# EAGLE design POIstick2 (EAGLE 8.4.0)
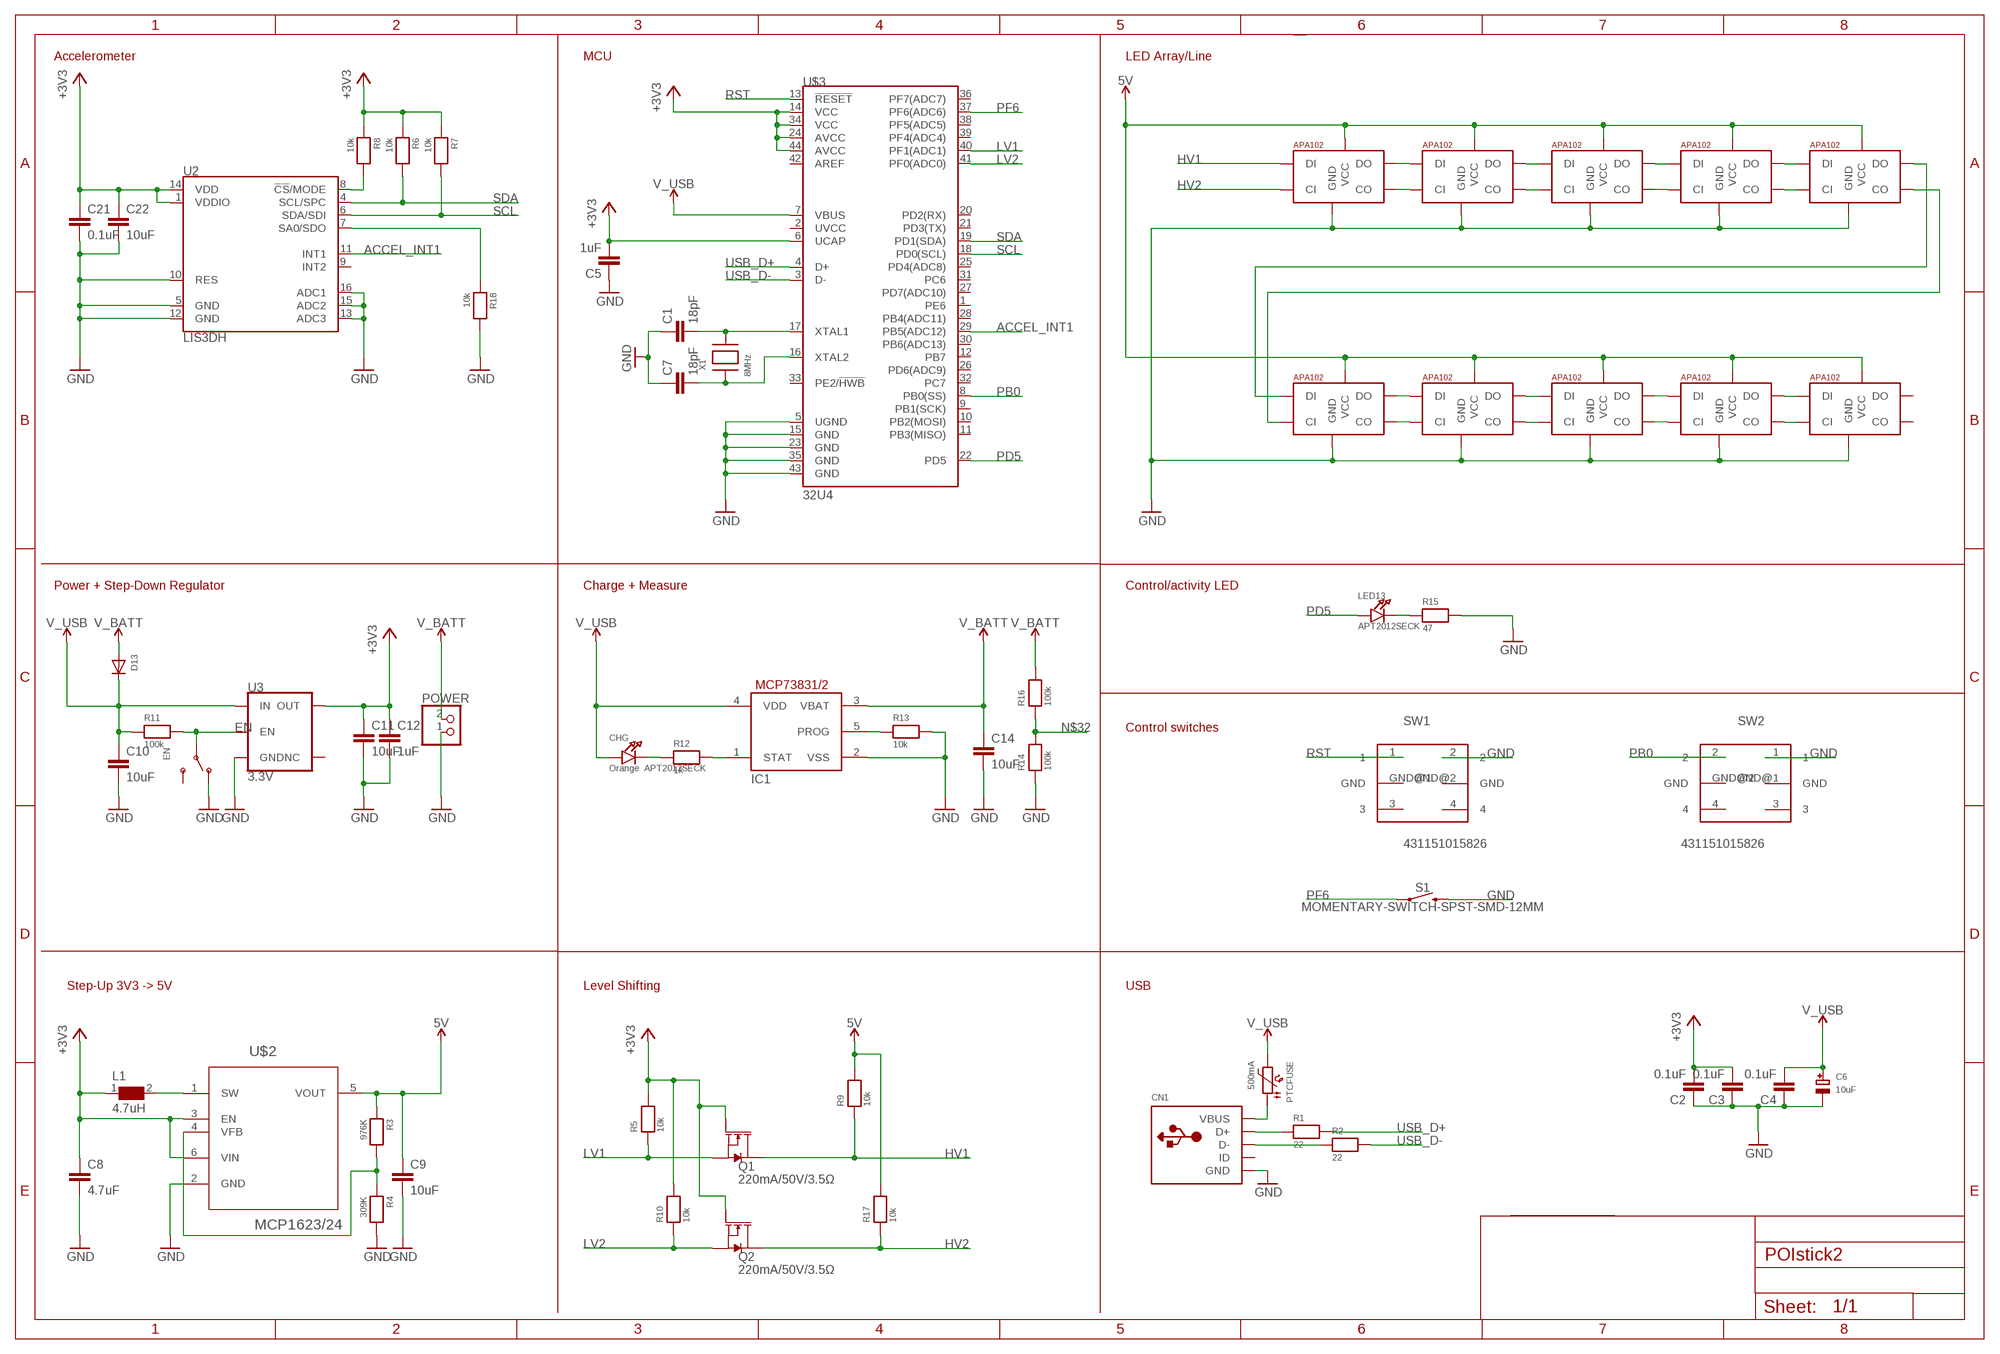
[diagram p0: schematic, sheet 1]

## Parts
C1  18pF  C-EUC0603K  [C0603K]
C2  0.1uF  C-EUC0603K  [C0603K]
C3  0.1uF  C-EUC0603K  [C0603K]
C4  0.1uF  C-EUC0603K  [C0603K]
C5  1uF  C-EUC0603K  [C0603K]
C6  10uF  CAP_TANTALUMA/3216_REFLOW  [EIA3216-18/A-R]
C7  18pF  C-EUC0603K  [C0603K]
C8  4.7uF  C-EUC0603K  [C0603K]
C9  10uF  C-EUC0603K  [C0603K]
C10  10uF  C-EUC0603K  [C0603K]
C11  10uF  C-EUC0603K  [C0603K]
C12  1uF  C-EUC0603K  [C0603K]
C14  10uF  C-EUC0603K  [C0603K]
C21  0.1uF  C-EUC0603K  [C0603K]
C22  10uF  C-EUC0603K  [C0603K]
CHG  Orange APT2012SECK  LED0603  [CHIPLED_0603]
CN1  USBMINIB  [USB-MINIB]
D13  DIODESOD-123  [SOD-123]
EN  SWITCH_SPDT  [SPDT_SMT_SSSS811101]
IC1  MCP73831/OT  [SOT23-5L]
L1  4.7uH  WE-TPC-744031004_3816  [WE-TPC_3816]
LED13  APT2012SECK  LED0603  [CHIPLED_0603]
POWER  JST_2PIN-THM  [JST-PH-2-THM]
PTCFUSE  500mA  PTC1206  [1206]
Q1  220mA/50V/3.5Ω  MOSFET-NCH-BSS138  [SOT23-3]
Q2  220mA/50V/3.5Ω  MOSFET-NCH-BSS138  [SOT23-3]
R1  22  RESISTOR0603  [0603]
R2  22  RESISTOR0603  [0603]
R3  976K  RESISTOR0603  [0603]
R4  309K  RESISTOR0603  [0603]
R5  10k  RESISTOR0603  [0603]
R6  10k  RESISTOR0603  [0603]
R7  10k  RESISTOR0603  [0603]
R8  10k  RESISTOR0603  [0603]
R9  10k  RESISTOR0603  [0603]
R10  10k  RESISTOR0603  [0603]
R11  100k  RESISTOR0603  [0603]
R12  1k  RESISTOR0603  [0603]
R13  10k  RESISTOR0603  [0603]
R14  100k  RESISTOR0603  [0603]
R15  47  RESISTOR0603  [0603]
R16  100k  RESISTOR0603  [0603]
R17  10k  RESISTOR0603  [0603]
R18  10k  RESISTOR0603  [0603]
S1  MOMENTARY-SWITCH-SPST-SMD-12MM  [TACTILE_SWITCH_SMD_12MM]
SW1  431151015826  [431181015816]
SW2  431151015826  [431181015816]
U2  LIS3DH  [LGA-16-3X3]
U3  3.3V  V_REG_AP2112K-3.3V  [SOT23-5]
U$2  MCP1623/24  [SOT95P300X120-6N]
U$3  32U4  ATMEGA32U4QFN  [QFN-44]
U$4  APA1025050  [APA102_5050]
U$5  APA1025050  [APA102_5050]
U$6  APA1025050  [APA102_5050]
U$7  APA1025050  [APA102_5050]
U$8  APA1025050  [APA102_5050]
U$9  APA1025050  [APA102_5050]
U$10  APA1025050  [APA102_5050]
U$11  APA1025050  [APA102_5050]
U$12  APA1025050  [APA102_5050]
U$13  APA1025050  [APA102_5050]
X1  8MHz  XTALNX5032  [NX5032]

## Nets
5V: C9.1 R3.1 R9.2 R17.2 U$2.5(VOUT) U$4.1(VCC) U$5.1(VCC) U$6.1(VCC) U$7.1(VCC) U$8.1(VCC) U$9.1(VCC) U$10.1(VCC) U$11.1(VCC) U$12.1(VCC) U$13.1(VCC)
+3V3: C2.2 C3.2 C5.2 C8.1 C11.1 C12.1 C21.1 C22.1 L1.1 Q1.1(G) Q2.1(G) R5.2 R6.1 R7.1 R8.1 R10.2 U2.1(VDDIO) U2.14(VDD) U3.5(OUT) U$2.3(EN) U$2.6(VIN) U$3.24(AVCC) U$3.44(AVCC)
ACCEL_INT1: U2.11(INT1) U$3.29(PB5(ADC12))
EN: EN.B(P) R11.2 U3.3(EN)
GND: C1.1 C2.1 C3.1 C4.1 C5.1 C6.- C7.1 C8.2 C9.2 C10.2 C11.2 C12.2 C14.2 C21.2 C22.2 CN1.GND EN.A(O) IC1.2(VSS) POWER.1 R4.2 R13.2 R14.1 R15.2 R18.2 S1.3 SW1.2 SW2.1 U2.5(GND) U2.10(RES) U2.12(GND) U2.13(ADC3) U2.15(ADC2) U2.16(ADC1) U3.2(GND) U$2.2(GND) U$4.6(GND) U$5.6(GND) U$6.6(GND) U$7.6(GND) U$8.6(GND) U$9.6(GND) U$10.6(GND) U$11.6(GND) U$12.6(GND) U$13.6(GND)
HV1: Q1.3(D) R9.1 U$4.4(DI)
HV2: Q2.3(D) R17.1 U$4.5(CI)
LV1: Q1.2(S) R5.1 U$3.40(PF1(ADC1))
LV2: Q2.2(S) R10.1 U$3.41(PF0(ADC0))
N$1: CN1.D+ R1.1
N$2: CN1.D- R2.1
N$3: R3.2 R4.1 U$2.4(VFB)
N$4: R18.1 U2.7(SA0/SDO)
N$5: CN1.VBUS PTCFUSE.1
N$6: C7.2 U$3.16(XTAL2) X1.P$1
N$7: C1.2 U$3.17(XTAL1) X1.P$2
N$8: U$4.3(DO) U$5.4(DI)
N$9: U$4.2(CO) U$5.5(CI)
N$10: U$5.3(DO) U$6.4(DI)
N$11: U$5.2(CO) U$6.5(CI)
N$12: U$6.3(DO) U$7.4(DI)
N$13: U$6.2(CO) U$7.5(CI)
N$14: U$7.3(DO) U$8.4(DI)
N$15: U$7.2(CO) U$8.5(CI)
N$16: U$8.3(DO) U$9.4(DI)
N$17: U$8.2(CO) U$9.5(CI)
N$18: R8.2 U2.8(!CS!/MODE)
N$19: L1.2 U$2.1(SW)
N$21: U$9.3(DO) U$10.4(DI)
N$22: U$9.2(CO) U$10.5(CI)
N$24: U$10.2(CO) U$11.5(CI)
N$25: U$10.3(DO) U$11.4(DI)
N$26: IC1.1(STAT) R12.2
N$27: U$11.3(DO) U$12.4(DI)
N$28: CHG.C R12.1
N$29: U$11.2(CO) U$12.5(CI)
N$30: IC1.5(PROG) R13.1
N$31: U$12.2(CO) U$13.5(CI)
N$32: LED13.C R14.2 R15.1 R16.1
N$35: U$12.3(DO) U$13.4(DI)
PB0: SW2.2 U$3.8(PB0(SS))
PD5: LED13.A U$3.22(PD5)
PF6: S1.1 U$3.37(PF6(ADC6))
RST: SW1.1 U$3.13(!RESET)
SCL: R7.2 U2.6(SDA/SDI) U$3.18(PD0(SCL))
SDA: R6.2 U2.4(SCL/SPC) U$3.19(PD1(SDA))
USB_D+: R1.2 U$3.4(D+)
USB_D-: R2.2 U$3.3(D-)
V_BATT: C14.1 D13.A IC1.3(VBAT) POWER.2 R16.2
V_USB: C4.2 C6.+ C10.1 CHG.A D13.C IC1.4(VDD) PTCFUSE.2 R11.1 U3.1(IN) U$3.7(VBUS)
Unconnected: CN1.ID EN.C(S) SW1.3 SW1.4 SW1.GND@1(GND) SW1.GND@2(GND) SW2.3 SW2.4 SW2.GND@1(GND) SW2.GND@2(GND) U2.9(INT2) U3.4(NC) U$3.1(PE6) U$3.2(UVCC) U$3.5(UGND) U$3.6(UCAP) U$3.9(PB1(SCK)) U$3.10(PB2(MOSI)) U$3.11(PB3(MISO)) U$3.12(PB7) U$3.14(VCC) U$3.15(GND) U$3.20(PD2(RX)) U$3.21(PD3(TX)) U$3.23(GND) U$3.25(PD4(ADC8)) U$3.26(PD6(ADC9)) U$3.27(PD7(ADC10)) U$3.28(PB4(ADC11)) U$3.30(PB6(ADC13)) U$3.31(PC6) U$3.32(PC7) U$3.33(PE2/!HWB) U$3.34(VCC) U$3.35(GND) U$3.36(PF7(ADC7)) U$3.38(PF5(ADC5)) U$3.39(PF4(ADC4)) U$3.42(AREF) U$3.43(GND) U$13.2(CO) U$13.3(DO)

## Notes on the sheet
- Accelerometer | MCU | LED Array/Line
- Power + Step-Down Regulator | Charge + Measure | Control/activity LED
- Control switches
- Step-Up 3V3 -> 5V | Level Shifting | USB

## Library data of the parts
C1-C5 C7-C12 C14 C21 C22 = rcl:C-EU: CAPACITOR, European symbol
C6 = microbuilder:CAP_TANTALUM: Tantalum Capacitors Wave footprints have larger pads and are meant to be used for hand soldering. Reflow footprints are optimised for solder paste and a reflow oven. EIA3216-18/A-[R/W] - Size A / 3216-18 / 1206 footprint 4.7µF 25V 10% Tantalum Capacitor 10µF 16V 10% Tantalum Capacitor [Digikey: 495-2236-2-ND] EIA3528-21/B-[R/W] - Size B / 3528-21 47µF 10V 10% Tantalum Capactior [Digikey: 495-2216-1-ND] EIA6032-28/C-[R/W] - Size C / 6032-28 10µF 35V 20% Tantalum Capacitor [Digikey: 495-2285-1-ND] 100µF 16V 10% Tantalum Capactior [Digikey: 399-5214-1-ND]
CHG LED13 = microbuilder:LED: LED 0603 - 0603 Surface Mount Package 2mA: Green LED - Low Power (3.9mcd, 2ma, 1.7Vf) - Digikey: 475-2709-2-ND Orange LED - Low Power (9.8mcd, 2ma, 1.8Vf) - Digikey: 475-1194-2-ND Red LED - Low Power (5mcd, 2ma, 1.8Vf) - Digikey: 475-1195-2-ND Yellow LED - Low Power (7mcd, 2ma, 1.8Vf) - Digikey: 475-1196-2-ND 5mA: Blue LED - Low Power (17mcd, 5ma, 2.9Vf) - Digikey: LNJ937W8CRACT-ND 0805 - 0805 Surface Mount Package 2mA: Red LED (8.8mcd, 2mA, 1.8Vf, Clear) - Low Power [Digikey: 475-2510-1-ND] Green LED (5mcd, 2mA, 1.8Vf, Clear) - Low Power [Digikey: 475-2730-1-ND] Yellow LED (11.3mcd, 2mA, 1.8Vf, Clear) - Low Power [Digikey: 475-2555-1-ND] 20mA: Red LED (104mcd, 20mA, Diffused) - LS R976 [Digikey: 475-1278-6-ND] Red LED (12mcd, 20mA, 2.0Vf, Clear) - APT2012EC [Digikey: 754-1128-1-ND] Green LED (15mcd, 20mA, 2.2Vf, Clear) - APT2012GC [Digikey: 754-1131-1-ND] Orange LED (160mcd, 20mA, 2.1Vf, Clear) - APT2012SECK [Digikey: 754-1130-1-ND] 1206 - 1206 Surface Mount Package Green LED (26mcd, 20mA, Diffused) - LG N971 [Digikey: 475-1407-6-ND] Red LED (15mcd, 20mA, Diffused) - LH N974 [Digikey: 475-1416-6-ND]
CN1 = adafruit:USB: USB Connectors USBMINIB - Surface Mount Female Mini-B USB Connector 4UConnector: 06564 By microbuilder.eu Thru-hole RA Female Mini-B USB Connector 4UConnector: 18732 By ladyada.net
D13 = adafruit:DIODE: Diode SMADIODE - SMA Surface Mount Package 20V 1A Schottky Diode Digikey: 641-1014-6-ND DO-1N4148 - Through Hole Small Current Diode SOD-123 20V 1 A (.5mV Vf) Schottky Diode - Digikey: MBRX120TPMSCT-ND SOD-323 10V 570mA (.38mV Vf, 3ns) Schottky Diode - Digikey: ZLLS410CT-ND SOD-523 30V 30mA Schottky Diode (RB751S-40TE61) - Digikey: RB751S-40TE61CT-ND SOT23-R/W - SOT23 Package (R = Solder Paste/Reflow Ovens, W = Hand-Soldering) BAT54Film 40V 300mA - Digikey: 497-7162-1-ND
EN = microbuilder:SWITCH_SPDT: Switch - SPDT SSSS811101 - Horizontal Two Position SMT, 0.3A 4V [Mouser: 688-SSSS811101]
IC1 = adafruit:MCP73831: MCP73831/2 Miniature Single-Cell, Fully Integrated Li-Ion, Li-Polymer Charge Management Controllers. Nice and small simple lipoly charge controller, with adjustable current and status output (LED) http://www.ladyada.net/library/pcb/eaglelibrary.html
L1 = WE-TPC:WE-TPC: Shielded Tiny Power Inductor WE-TPC - Extremely flat power inductor - High current capability - High reliability and perfect soldering characteristics because of integrated soldering pad - magnetically shielded -- Portable power like PDA, digital camera, PCMICA-cards and displays -- DC/DC-converter -- Recommended for switching regulator IC's from Linear Technology, National Semiconductor, Texas Instruments and Fairchild Semiconductor; MPN: 744031004; OC_FARNELL: 1635834; OC_NEWARK: 08P2473; PACKAGE: 3816; SUPPLIER: WURTH ELEKTRONIK
POWER = adafruit:JST_2PIN: JST 2-Pin Connectors of various flavors SMT-RA (S2B-PH-SM4) 4UConnector #17311 SMT (B2B-PH-SM4) THM-RA (S2B-PH) THM (B2B-PH)
PTCFUSE = microbuilder:PTC: PTC (Resettable Fuse) 1206 Package 250mA PTC (16V Max, Time-to-Trip: 0.08s) - Digikey: F2110CT-ND 1210 Package 100mA PTC (30V Max, Time-to-Trip: 0.6s) - Digikey: MF-USMF010-2CT-ND 1812 Package 750mA PTC (24V Max, Time-to-Trip: 0.2s) - Digikey: MF-MSMF075/24-2CT-ND
Q1 Q2 = SparkFun-DiscreteSemi:MOSFET-NCH: N-channel MOSFETs Voltage controlled devices that allow control of high current outputs. SparkFun Products: SparkFun OpenScale <https://www.sparkfun.com/products/13261> SparkFun Digital Sandbox <https://www.sparkfun.com/products/12651> SparkFun Monster Moto Shield <https://www.sparkfun.com/products/10182> SparkFun MOSFET Power Controller <https://www.sparkfun.com/products/11214>; PROD_ID: TRANS-00830
R1-R18 = microbuilder:RESISTOR: Resistors 0402 - 0402 Surface Mount Package 22 Ohm 1% 1/16W [Digikey: 311-22.0LRTR-ND] 33 Ohm 5% 1/16W 1.0K 5% 1/16W 1.5K 5% 1/16W 2.0K 1% 1/16W 10.0K 1% 1/16W [Digikey: 311-10.0KLRTR-ND] 10.0K 5% 1/16W [Digikey: RMCF0402JT10K0TR-ND] 12.1K 1% 1/16W [Digikey: 311-22.0LRTR-ND] 100.0K 5% 1/16W 0603 - 0603 Surface Mount Package 0 Ohm 1/10 Watt 1% Resistor 15 Ohm 1/10 Watt 1% Resistor 33 Ohm 1/10 Watt 1% Resistor 49.9 Ohm 1/10 Watt 1% Resistor 100 Ohm 1/10 Watt 1% Resistor 150 Ohm 1/10 Watt 1% Resistor 240 Ohm 1/10 Watt 1% Resistor 390 Ohm 1/10 Watt 1% Resistor 560 Ohm 1/10 Watt 1% Resistor 680 Ohm 1/10 Watt 1% Resistor 750 Ohm 1/10 Watt 1% Resistor 1.0K Ohm 1/10 Watt 1% Resistor 1.5K Ohm 1/10 Watt 1% Resistor 2.0K Ohm 1/10 Watt 1% Resistor 2.2K Ohm 1/10 Watt 1% Resistor 3.3K Ohm 1/10 Watt 1% Resistor 4.7K Ohm 1/10 Watt 1% Resistor 10.0K Ohm 1/10 Watt 1% Resistor 12.0K Ohm 1/10 Watt 1% Resistor 12.1K Ohm 1/10 Watt 1% Resistor 20.0K Ohm 1/10 Watt 1% Resistor 33.0K Ohm 1/10 Watt 1% Resistor 100.0K Ohm 1/10 Watt 1% Resistor 0805 - 0805 Surface Mount Package 0 Ohm 1/8 Watt 1% Resistor 33 Ohm 1/8 Watt 1% Resistor 100 Ohm 1/8 Watt 1% Resistor 150 Ohm 1/8 Watt 1% Resistor 200 Ohm 1/8 Watt 1% Resistor 240 Ohm 1/8 Watt 1% Resistor 330 Ohm 1/8 Watt 1% Resistor 390 Ohm 1/8 Watt 1% Resistor 470 Ohm 1/8 Watt 1% Resistor 1.0K Ohm 1/8 Watt 1% Resistor 1.5K Ohm 1/8 Watt 1% Resistor 2.0K Ohm 1/8 Watt 1% Resistor 4.7K Ohm 1/8 Watt 1% Resistor 5.1K Ohm 1/8 Watt 1% Resistor 5.6K Ohm 1/8 Watt 1% Resistor 10.0K Ohm 1/8 Watt 1% Resistor 22.0K Ohm 1/8 Watt 1% Resistor 33.0K Ohm 1/8 Watt 1% Resistor 100K Ohm 1/8 Watt 1% Resistor 1206 - 1206 Surface Mount Package 2012 - 2010 Surface Mount Package 0.11 Ohm 1/2 Watt 1% Resistor - Digikey: RHM.11UCT-ND
S1 = SparkFun-Switches:MOMENTARY-SWITCH-SPST: Momentary Switch (Pushbutton) - SPST Normally-open (NO) SPST momentary switches (buttons, pushbuttons). Variants PTH-12MM - 12mm square, through-hole Momentary Pushbutton Switch - 12mm Square <https://www.sparkfun.com/products/9190> (COM-09190) PTH-6.0MM, PTH-6.0MM-KIT - 6.0mm square, through-hole Mini Pushbutton Switch <https://www.sparkfun.com/products/97> (COM-00097) KIT package intended for soldering kit's - only one side of pads' copper is exposed. PTH-RIGHT-ANGLE-KIT - Right-angle, through-hole Right Angle Tactile Button <https://www.sparkfun.com/products/10791> - Used on SparkFun BigTime Watch Kit <https://www.sparkfun.com/products/11734> SMD-12MM - 12mm square, surface-mount Tactile Button - SMD (12mm) <https://www.sparkfun.com/products/12993> (COM-12993) Used on SparkFun PicoBoard <https://www.sparkfun.com/products/11888> SMD-4.5MM - 4.5mm Square Trackball Switch Used on SparkFun Blackberry Trackballer Breakout <https://www.sparkfun.com/products/13169> SMD-4.6MMX2.8MM - 4.60mm x 2.80mm, surface mount Used on SparkFun SAMD21 Mini Breakout <https://www.sparkfun.com/products/13664> SMD-5.2MM, SMD-5.2-REDUNDANT - 5.2mm square, surface-mount Mini Pushbutton Switch - SMD <https://www.sparkfun.com/products/8720> (COM-08720) Used on Arduino Pro Mini <https://www.sparkfun.com/products/11114> REDUNDANT package connects both switch circuits together SMD-6.0X3.5MM - 6.0 x 3.5mm, surface mount Momentary Reset Switch SMD <https://www.sparkfun.com/products/8229> (COM-08229) SMD-6.2MM-TALL - 6.2mm square, surface mount Tactile Button - SMD (6mm) <https://www.sparkfun.com/products/12992> Used on SparkFun Digital Sandbox <https://www.sparkfun.com/products/12651> SMD-RIGHT-ANGLE - Right-angle, surface mount Used on SparkFun Block for Intel® Edison - Arduino <https://www.sparkfun.com/products/13036>; PROD_ID: SWCH-11967; SF_SKU: COM-12993
SW1 SW2 = Wurth_Elektronik_Electromechanic_Switchs_rev15b:431151015826: WS-TSS-5x5 mm SMD Tact Switch with ground terminal, 4 pins
U2 = SparkFun-Sensors:LIS3DH: ST Microelectronics LIS3DH 3-Axis ±2/4/8/16g SPI/I2C Accelerometer The LIS3DH is a three axis MEMS linear accelerometer in the "nano" family. It has a digital I2C/SPI serial interface which makes it ideal for using in embedded applications. The device also features ultra low-power operational modes that allow advanced power saving and smart sleep to wake-up functions, built in detections with interrupts, and auxiliary ADC inputs Datasheet-XXXX <http://www.sparkfun.com/datasheets/Sensors/Accelerometer/LIS3DH.pdf> SparkFun Products SparkFun Triple Axis Accelerometer Breakout - LIS3DH <https://www.sparkfun.com/products/10345> (SEN-XXXXX) Triple Axis Accelerometer - LIS3DH <https://www.sparkfun.com/products/9755> (SEN-XXXXX); PROD_ID: IC-13419; SF_ID: N/A
U3 = SparkFun-IC-Power:V_REG_AP2112: AP2112 - 600mA CMOS LDO Regulator w/ Enable The AP2112 is CMOS process low dropout linear regulator with enable function, the regulator delivers a guaranteed 600mA (min.) continuous load current. Features Output Voltage Accuracy: ±1.5% Output Current: 600mA (Min.) Foldback Short Current Protection: 50mA Enable Function to Turn ON/OFF VOUT Low Dropout Voltage (3.3V): 250mV (Typ.) @IOUT=600mA Excellent Load Regulation: 0.2%/A (Typ.) Excellent Line Regulation: 0.02%/V (Typ.) Low Quiescent Current: 55μA (Typ.) Low Standby Current: 0.01μA (Typ.) Low Output Noise: 50μVRMS PSRR: 100Hz -65dB, 1kHz -65dB OTSD Protection Stable with 1.0μF Flexible Cap: Ceramic, Tantalum and Aluminum Electrolytic Operation Temperature Range: -40°C to 85°C ESD: MM 400V, HBM 4000V; PROD_ID: VREG-12457
U$2 = MCP1623:MCP1623/24: IC, BOOST, REG, PWM/PFM, SOT-23-6 Primary Input Voltage: 5.5V No. of Outputs: 1 Output Voltage: 5.5V Output Current: 50mA Voltage Regulator Case Style: SOT-23 No. of Pins: 6 Operating Temperature Range: -40°C to +85°C SVHC: No SVHC (18-Jun-2012) Base Number: 1623
U$3 = SparkFun-IC-Microcontroller:ATMEGA32U4: Atmel MCU, 32KByte Atmel 44-pin 8-bit Microcontroller with 32KBytes of ISP Flash and USB Controller Datasheet <http://cdn.sparkfun.com/datasheets/Dev/Arduino/Boards/ATMega32U4.pdf> SparkFun Products LilyPad Arduino USB - ATmega32U4 Board <https://www.sparkfun.com/products/12049> (DEV-12049) Pro Micro - 5V/16MHz <https://www.sparkfun.com/products/12640> (DEV-12640) Pro Micro - 3.3V/8MHz <https://www.sparkfun.com/products/12587> (DEV-12587) Fio v3 - ATmega32U4 <https://www.sparkfun.com/products/11520> (DEV-11520) Qduino Mini <https://www.sparkfun.com/products/13614> (DEV-13614) Makey Makey - Standard Kit <https://www.sparkfun.com/products/11511> (WIG-11511) Makey Makey Deluxe Kit <https://www.sparkfun.com/products/11519> (WIG-11519); PROD_ID: IC-10828
U$4-U$13 = jos-ph:APA102: APA102C 5050 RGB LED -- Adafruit DotStar Single LED Pixel Product Page: https://www.adafruit.com/products/2343 Datasheet: https://cdn-shop.adafruit.com/product-files/2343/APA102C.pdf
X1 = adafruit:XTAL: Low cost SMT crystals, no capacitors included http://www.ladyada.net/library/eagle

## Board
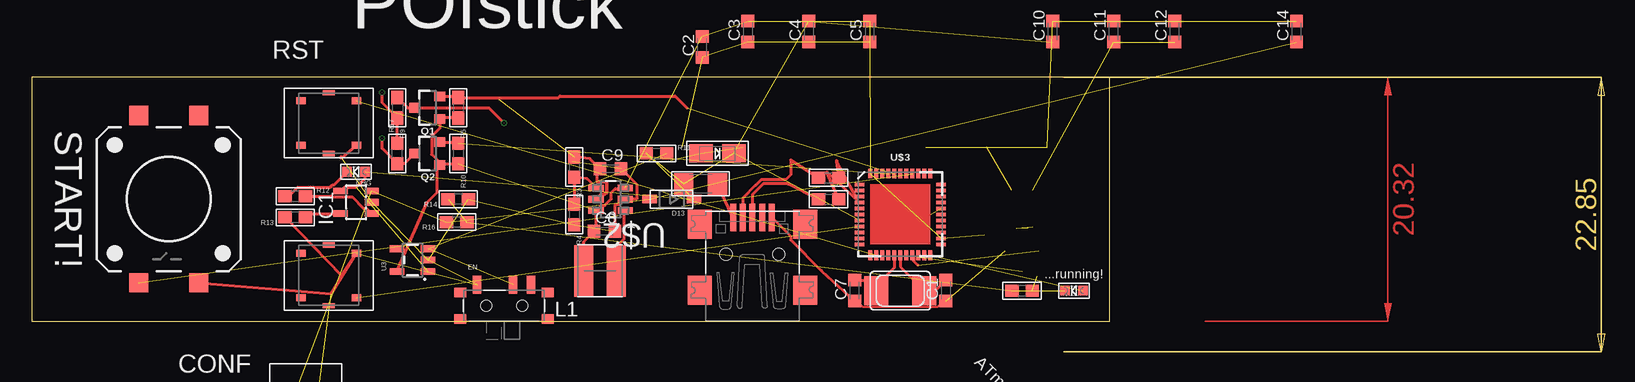
[diagram p1: board, top side]
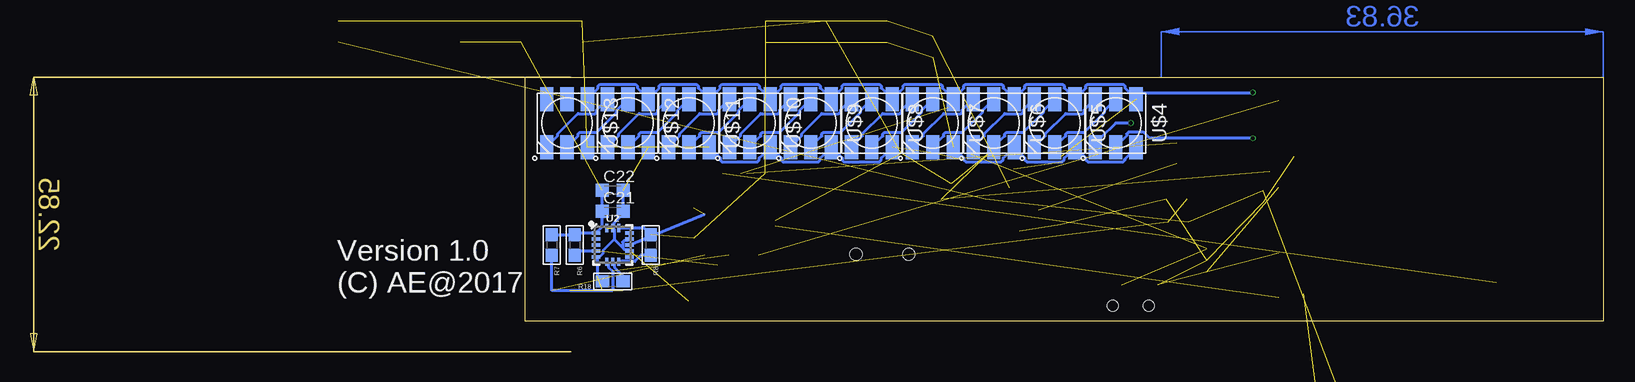
[diagram p2: board, bottom side, seen from below]

Size 89.84 x 20.31 mm. Coordinates in mm from the lower left corner, seen from the top.
Outline: 0,0 89.84,0 89.84,20.31 0,20.31 0,0
Copper layers (1*16): Top 0.035mm / dielectric 1.5mm / Bottom 0.035mm
Design rules "aisler_go_2layer": minimum track width 0.1mm, minimum drill 0.2mm, track to track 0.1mm, track to pad 0.1mm, pad to pad 0.1mm, via to via 0.1mm, smd to smd 0.1mm, copper to edge 0.2mm, drill to drill 0.21mm, minimum pad ring 0.25mm, minimum via ring 0.05mm, stop-mask expansion 0.01mm, vias tented up to drill 0mil, thermal gap 10mil

### Footprints (pad centres in the part's own frame; a part is rotated, then mirrored left to right if it is on the bottom)
C0603K = smd 1.05 x 1.08: 1 -0.875,0; 2 0.875,0
EIA3216-18/A-R = smd 1.95 x 1.5: + 1.375,0; - -1.375,0
CHIPLED_0603 = smd 0.8 x 0.8: A 0,-0.75; C 0,0.75
USB-MINIB = smd 0.5 x 2.308: D+ 0,4.064; D- -0.8,4.064; GND 1.6,4.064; ID 0.8,4.064; VBUS -1.6,4.064 | smd 2 x 2.4: GND1 -4.4,-2; GND2 -4.4,3.5; GND3 4.4,3.5; GND4 4.4,-2 | hole 1: -2.2,1; 2.2,1
SOD-123 = smd 1.2 x 0.7: A 1.85,0; C -1.85,0
SPDT_SMT_SSSS811101 = smd 0.7 x 1.5: A -2.25,1.75; B 0.75,1.75; C 2.25,1.75 | smd 1 x 0.8: SUP1 -3.65,1.1; SUP2 -3.65,-1.1; SUP3 3.65,1.1; SUP4 3.65,-1.1 | hole 0.9: -1.5,0; 1.5,0
SOT23-5L = smd 0.55 x 1.2: 1 -0.95,-1.3; 2 0,-1.3; 3 0.95,-1.3; 4 0.95,1.3; 5 -0.95,1.3
WE-TPC_3816 = smd 1.6 x 4.3: 1 -1.356,-0.014; 2 1.356,-0.014
JST-PH-2-THM = drill 0.8 pad 1.422: 1 1,0; 2 -1,0
1206 = smd 1.6 x 1.8: 1 -1.4,0; 2 1.4,0
SOT23-3 = smd 0.8 x 0.9: 1 -0.95,-1; 2 0.95,-1; 3 0,1.1
0603 = smd 1.1 x 1: 1 -0.85,0; 2 0.85,0
TACTILE_SWITCH_SMD_12MM = smd 1.6 x 1.55: 1 6.975,-2.5; 2 -6.975,-2.5; 3 6.975,2.5; 4 -6.975,2.5
431181015816 = smd 0.8 x 0.6: 1 -2.3,-1.85; 2 -2.3,1.85; 3 2.3,-1.85; 4 2.3,1.85 | smd 1 x 0.45: GND@1 0,-2.525; GND@2 0,2.525
LGA-16-3X3 = smd 0.7 x 0.28: 1 -1.4,1; 2 -1.4,0.5; 3 -1.4,0; 4 -1.4,-0.5; 5 -1.4,-1; 9 1.4,-1; 10 1.4,-0.5; 11 1.4,0; 12 1.4,0.5; 13 1.4,1 | smd 0.28 x 0.7: 6 -0.5,-1.4; 7 0,-1.4; 8 0.5,-1.4; 14 0.5,1.4; 15 0,1.4; 16 -0.5,1.4
SOT23-5 = smd 0.55 x 1.2: 1 -0.95,-1.3; 2 0,-1.3; 3 0.95,-1.3; 4 0.95,1.3; 5 -0.95,1.3
SOT95P300X120-6N = smd 1.27 x 0.559: 1 -1.219,0.94; 2 -1.219,0; 3 -1.219,-0.94; 4 1.219,-0.94; 5 1.219,0; 6 1.219,0.94
QFN-44 = smd 0.8 x 0.3: 1 -3.4,2.5; 2 -3.4,2; 3 -3.4,1.5; 4 -3.4,1; 5 -3.4,0.5; 6 -3.4,0; 7 -3.4,-0.5; 8 -3.4,-1; 9 -3.4,-1.5; 10 -3.4,-2; 11 -3.4,-2.5; 23 3.4,-2.5; 24 3.4,-2; 25 3.4,-1.5; 26 3.4,-1; 27 3.4,-0.5; 28 3.4,0; 29 3.4,0.5; 30 3.4,1; 31 3.4,1.5; 32 3.4,2; 33 3.4,2.5 | smd 0.3 x 0.8: 12 -2.5,-3.4; 13 -2,-3.4; 14 -1.5,-3.4; 15 -1,-3.4; 16 -0.5,-3.4; 17 0,-3.4; 18 0.5,-3.4; 19 1,-3.4; 20 1.5,-3.4; 21 2,-3.4; 22 2.5,-3.4; 34 2.5,3.4; 35 2,3.4; 36 1.5,3.4; 37 1,3.4; 38 0.5,3.4; 39 0,3.4; 40 -0.5,3.4; 41 -1,3.4; 42 -1.5,3.4; 43 -2,3.4; 44 -2.5,3.4
APA102_5050 = smd 2 x 1.1: 1 2,-1.7; 2 2,0; 3 2,1.7; 4 -2,1.7; 5 -2,0; 6 -2,-1.7
NX5032 = smd 2 x 2.4: P$1 2,0; P$2 -2,0

### Placement (x,y rotation side)
C1  76.2,2.54 90 top
C2  55.88,22.86 90 top
C3  59.69,24.13 90 top
C4  64.77,24.13 90 top
C5  69.85,24.13 90 top
C6  57.15,13.97 0 top
C7  68.58,2.54 90 top
C8  47.75,7.49 0 top
C9  48.26,12.7 0 top
C10  85.09,24.13 90 top
C11  90.17,24.13 90 top
C12  95.25,24.13 90 top  (outside the outline)
C14  105.41,24.13 90 top  (outside the outline)
C21  82.55,9.14 0 bottom
C22  82.55,10.92 0 bottom
CHG  27.05,12.45 90 top
CN1  60.07,4.57 0 top
D13  53.34,10.16 180 top
EN  39.37,1.27 0 top
IC1  27.05,9.91 90 top
L1  47.37,4.19 0 top
LED13  86.87,2.54 90 top
POWER  22.86,-6.35 0 top  (outside the outline)
PTCFUSE  55.75,11.43 180 top
Q1  33.02,17.78 90 top
Q2  33.02,13.97 90 top
R1  66.42,10.16 0 top
R2  66.42,11.94 0 top
R3  45.21,12.83 270 top
R4  45.21,8.89 270 top
R5  35.56,17.78 270 top
R6  85.73,6.35 270 bottom
R7  87.63,6.35 270 bottom
R8  79.38,6.35 270 bottom
R9  30.48,17.78 270 top
R10  35.56,13.97 270 top
R11  52.07,13.97 0 top
R12  21.97,10.41 0 top
R13  21.97,8.64 180 top
R14  35.56,10.16 180 top
R15  82.55,2.54 0 top
R16  35.43,8.25 180 top
R17  30.48,13.97 90 top
R18  82.55,3.3 180 bottom
S1  11.43,10.16 270 top
SW1  24.76,16.51 180 top
SW2  24.76,3.81 180 top
U2  82.55,6.35 0 bottom
U3  31.75,5.08 90 top
U$2  48.26,10.16 180 top
U$3  72.39,8.89 0 top
U$4  40.64,16.51 90 bottom
U$5  45.72,16.51 90 bottom
U$6  50.8,16.51 90 bottom
U$7  55.88,16.51 90 bottom
U$8  60.96,16.51 90 bottom
U$9  66.04,16.51 90 bottom
U$10  71.12,16.51 90 bottom
U$11  76.2,16.51 90 bottom
U$12  81.28,16.51 90 bottom
U$13  86.36,16.51 90 bottom
X1  72.39,2.54 180 top

### Tracks (layer width: path | path; a pad name or v marks a point on that pad's centre or on a via)
5V  (via drill 0.35)  (1 unrouted)
  Top 0.254: R17.2 R9.2 29.21,18.2 v29.21,19.05 | R3.1 46.53,13.55 C9.1 47.14,12.46 47.14,11.63
  Top 0.305: 47.14,11.63 47.78,11.63 47.93,11.48 47.93,10.72 47.78,10.57 47.46,10.57 U$2.5
  Bottom 0.254: U$13.1 83.76,19.41 83.76,19.6 83.62,19.74 80.64,19.74 80.5,19.6 80.5,19.43 U$12.1 78.68,19.41 78.68,19.6 78.54,19.74 75.56,19.74 75.42,19.6 75.42,19.43 U$11.1 73.6,19.41 73.6,19.6 73.46,19.74 70.48,19.74 70.34,19.6 70.34,19.43 U$10.1 68.52,19.41 68.52,19.6 68.38,19.74 65.4,19.74 65.26,19.6 65.26,19.43 U$9.1 63.44,19.41 63.44,19.6 63.3,19.74 60.32,19.74 60.18,19.6 60.18,19.43 U$8.1 58.36,19.41 58.36,19.6 58.22,19.74 55.24,19.74 55.1,19.6 55.1,19.43 U$7.1 53.28,19.41 53.28,19.6 53.14,19.74 50.16,19.74 50.02,19.6 50.02,19.43 U$6.1 48.2,19.41 48.2,19.6 48.06,19.74 45.08,19.74 44.94,19.6 44.94,19.43 U$5.1 43.12,19.41 43.12,19.6 42.98,19.74 40,19.74 39.86,19.6 39.86,19.43 39.42,18.99 | 39.42,18.99 U$4.1 | v29.21,19.05 29.26,18.99 39.42,18.99
+3V3  (10 unrouted)
  Top 0.254: R5.2 34.12,16.93 Q1.1 34.02,16.09 33.34,15.41 33.34,13.9 34.12,13.12 | 34.12,13.12 Q2.1 33.82,12.82 33.82,10.74 32.99,9.91 U3.5 | 34.12,13.12 R10.2 | U$2.3 49.43,11.05 48.64,11.05 48.31,10.72 48.31,10.19 47.77,9.65 47.47,9.65 U$2.6 47.04,7.96 C8.1 46.02,6.63 L1.1
  Bottom 0.254: R7.1 R6.1 85.58,7.35 U2.1 83.42,7.88 C21.1 C22.1 | R8.1 79.92,7.75 U2.14
ACCEL_INT1  (1 unrouted)
  Bottom 0.254: U2.11 74.93,8.89
EN  (2 unrouted)
GND  (25 unrouted)
  Top 0.152: C1.1 75.96,1.66 75.46,1.16 69.32,1.16 68.82,1.66 C7.1
  Top 0.254: S1.3 24.97,2.3 SW2.1 25.79,3.84 R13.2 | SW1.2 25.79,13.58 25.78,13.72 | CN1.GND 63.24,7.06 63.24,6.78 65.82,4.2 C7.1 | C8.2 48.62,7.5 48.62,9.59 48.75,9.73 49.05,9.73 U$2.2 50.42,10.16 50.42,11.42 C9.2
  Bottom 0.254: U$11.6 73.6,13.61 73.6,13.42 73.46,13.28 70.48,13.28 70.34,13.42 70.34,13.59 U$10.6 68.52,13.61 68.52,13.42 68.38,13.28 65.4,13.28 65.26,13.42 65.26,13.59 U$9.6 63.44,13.61 63.44,13.42 63.3,13.28 60.32,13.28 60.18,13.42 60.18,13.59 U$8.6 | U$7.6 53.28,13.61 53.28,13.42 53.14,13.28 50.16,13.28 50.02,13.42 50.02,13.59 U$6.6 48.2,13.61 48.2,13.42 48.06,13.28 45.08,13.28 44.94,13.42 44.94,13.59 U$5.6 43.12,13.61 43.12,13.42 42.98,13.28 40,13.28 39.86,13.42 39.86,13.48 39.37,13.97 39.37,14.08 U$4.6 | C22.2 C21.2 81.67,8.94 82.42,8.19 82.42,7.88 U2.15 82.42,7.62 82.42,6.81 | U2.10 81.28,5.98 81.59,5.98 81.73,6.12 | 82.42,6.81 81.73,6.12 | U2.13 U2.12 81.28,6.72 81.59,6.72 81.73,6.58 81.73,6.12 | R18.2 83.82,3.72 83.82,5.08 83.95,5.21 U2.5 83.64,5.35 83.37,5.62 83.37,5.85 82.42,6.81
HV1  (via drill 0.35)
  Top 0.254: R9.1 31.33,17.78 Q1.3 38.1,17.78 v39.37,16.51
  Bottom 0.254: v39.37,16.51 40.64,16.51 41.91,15.24 41.91,14.94 U$4.4
HV2  (via drill 0.35)
  Top 0.254: Q2.3 31.07,13.12 R17.1 29.21,14.39 v29.21,15.24
  Bottom 0.254: U$4.5 39.72,15.43 39.72,15.6 39.58,15.74 38.3,15.74 37.8,15.24 v29.21,15.24
LV1  (1 unrouted)
  Top 0.254: Q1.2 35.46,18.73 R5.1 43.9,18.63 44.03,18.76 53.63,18.76 54.61,17.78
LV2  (1 unrouted)
  Top 0.254: Q2.2 35.46,14.92 R10.1
N$1
  Top 0.254: R1.1 63.03,11.43 60.96,11.43 60.07,10.54 CN1.D+
N$2
  Top 0.254: R2.1 63.25,13.42 63.25,12.19 62.84,11.78 60.81,11.78 60.33,11.3 59.27,10.25 CN1.D-
N$3
  Top 0.254: U$2.4 46.29,11.85 R3.2 R4.1
N$4
  Bottom 0.254: U2.7 82.42,4.82 82.42,4.51 81.7,3.79 R18.1
N$5
  Top 0.254: CN1.VBUS 58.42,8.68 PTCFUSE.1
N$6
  Top 0.254: U$3.16 71.89,4.45 71.12,3.68 71.12,3.27 70.5,2.65 | 70.5,2.65 X1.P$1 | C7.2 69.74,3.41 70.5,2.65
N$7
  Top 0.254: U$3.17 72.39,4.54 X1.P$2 75.33,2.54 C1.2
N$8
  Bottom 0.254: U$4.3 43.24,17.61 43.24,17.42 43.38,17.28 44.82,17.28 46.5,15.6 46.5,15.43 U$5.4
N$9
  Bottom 0.254: U$4.2 41.56,17.59 41.56,17.42 43.24,15.74 44.66,15.74 44.8,15.6 44.8,15.43 U$5.5
N$10
  Bottom 0.254: U$5.3 48.32,17.61 48.32,17.42 48.46,17.28 49.9,17.28 51.58,15.6 51.58,15.43 U$6.4
N$11
  Bottom 0.254: U$5.2 46.64,17.59 46.64,17.42 48.32,15.74 49.74,15.74 49.88,15.6 49.88,15.43 U$6.5
N$12
  Bottom 0.254: U$6.3 53.4,17.61 53.4,17.42 53.54,17.28 54.98,17.28 56.66,15.6 56.66,15.43 U$7.4
N$13
  Bottom 0.254: U$6.2 51.72,17.59 51.72,17.42 53.4,15.74 54.82,15.74 54.96,15.6 54.96,15.43 U$7.5
N$14
  Bottom 0.254: U$7.3 58.48,17.61 58.48,17.42 58.62,17.28 60.06,17.28 61.74,15.6 61.74,15.43 U$8.4
N$15
  Bottom 0.254: U$7.2 56.8,17.59 56.8,17.42 58.48,15.74 59.9,15.74 60.04,15.6 60.04,15.43 U$8.5
N$16
  Bottom 0.254: U$8.3 63.56,17.61 63.56,17.42 63.7,17.28 65.14,17.28 66.82,15.6 66.82,15.43 U$9.4
N$17
  Bottom 0.254: U$8.2 61.88,17.59 61.88,17.42 63.56,15.74 64.98,15.74 65.12,15.6 65.12,15.43 U$9.5
N$18
  Bottom 0.254: R8.2 80.19,5.5 80.71,4.98 82.02,4.98 U2.8
N$19
  Top 0.254: L1.2 48.73,6.21 49.38,6.86 49.38,9.12 U$2.1
N$21
  Bottom 0.254: U$9.3 68.64,17.61 68.64,17.42 68.78,17.28 70.22,17.28 71.9,15.6 71.9,15.43 U$10.4
N$22
  Bottom 0.254: U$9.2 66.96,17.59 66.96,17.42 68.64,15.74 70.06,15.74 70.2,15.6 70.2,15.43 U$10.5
N$24
  Bottom 0.254: U$10.2 72.04,17.59 72.04,17.42 73.72,15.74 75.14,15.74 75.28,15.6 75.28,15.43 U$11.5
N$25
  Bottom 0.254: U$10.3 73.72,17.61 73.72,17.42 73.86,17.28 75.3,17.28 76.98,15.6 76.98,15.43 U$11.4
N$26
  Top 0.254: R12.2 25,10.41 25.06,10.35 26.71,10.35 27.66,9.4 27.9,9.4 IC1.1
N$27
  Bottom 0.254: U$11.3 78.8,17.61 78.8,17.42 78.94,17.28 80.38,17.28 82.06,15.6 82.06,15.43 U$12.4
N$28
  Top 0.254: R12.1 21.45,10.41 22.18,11.14 23.21,11.14 23.24,11.18 24.87,11.18 25.06,11.36 25.21,11.36 CHG.C
N$29
  Bottom 0.254: U$11.2 77.12,17.59 77.12,17.42 78.8,15.74 80.22,15.74 80.36,15.6 80.36,15.43 U$12.5
N$30
  Top 0.254: R13.1 23.14,8.96 IC1.5
N$31
  Bottom 0.254: U$12.2 82.2,17.59 82.2,17.42 83.88,15.74 85.3,15.74 85.44,15.6 85.44,15.43 U$13.5
N$32  (3 unrouted)
N$35
  Bottom 0.254: U$12.3 83.88,17.61 83.88,17.42 84.02,17.28 85.46,17.28 87.14,15.6 87.14,15.43 U$13.4
PB0  (1 unrouted)
PD5  (1 unrouted)
PF6  (1 unrouted)
RST  (1 unrouted)
SCL  (1 unrouted)
  Bottom 0.254: U2.6 82.92,4.82 82.92,4.5 82.55,4.14 82.55,2.54 87.63,2.54 R7.2
SDA  (1 unrouted)
  Top 0.254: U$3.19 73.51,5.37 73.51,5 73.85,4.66
  Bottom 0.254: R6.2 85.38,5.85 U2.4
USB_D+
  Top 0.254: R1.2 66.27,12.43 U$3.4
USB_D-
  Top 0.254: R2.2 67.09,13.39 67.09,13.19 68.62,10.39 U$3.3
V_BATT  (4 unrouted)
V_USB  (8 unrouted)
  Top 0.254: IC1.4 26.07,11.18 27.05,11.18 27.8,11.93 CHG.A
(copper drawn outside any net)
  shapes: Bottom area x1, Top area x1

### Text on the board
tNames: POIstick | RST | START! | ...running! | CONF | ATmega32U4
bNames: Version 1.0 / (C) AE@2017